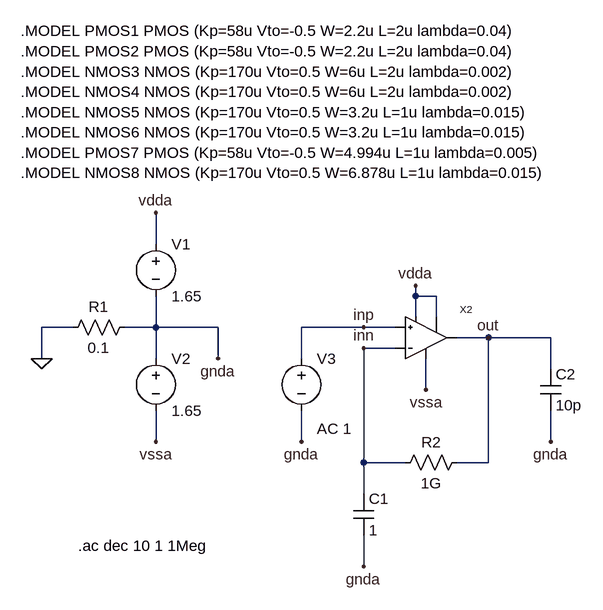
[diagram p0: schematic CMOSamp-TOP-frecuencia.asc]
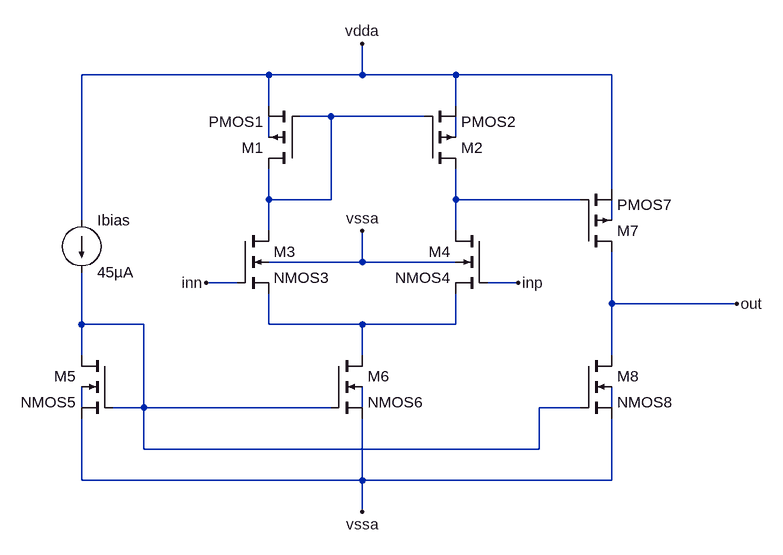
[diagram p1: sub-circuit cmosamp.asc]
CMOSamp-TOP-frecuencia.asc, the LTspice schematic file:
Version 4
SHEET 1 1168 844
WIRE -384 32 -384 -16
WIRE 16 112 16 96
WIRE 48 112 16 112
WIRE 16 144 16 112
WIRE 48 144 48 112
WIRE -512 160 -560 160
WIRE -384 160 -384 112
WIRE -384 160 -432 160
WIRE -288 160 -384 160
WIRE -64 160 -160 160
WIRE -16 160 -64 160
WIRE 128 176 80 176
WIRE 224 176 128 176
WIRE -16 192 -64 192
WIRE -560 208 -560 160
WIRE -384 208 -384 160
WIRE -288 208 -288 160
WIRE -160 208 -160 160
WIRE 224 224 224 176
WIRE 32 256 32 208
WIRE -384 336 -384 288
WIRE -160 336 -160 288
WIRE 224 336 224 288
WIRE -64 368 -64 192
WIRE 0 368 -64 368
WIRE 128 368 128 176
WIRE 128 368 80 368
WIRE -64 416 -64 368
WIRE -64 528 -64 480
FLAG -288 208 gnda
FLAG -560 208 0
FLAG -384 -16 vdda
FLAG 16 96 vdda
FLAG 32 256 vssa
FLAG -384 336 vssa
FLAG -64 160 inp
FLAG -64 192 inn
FLAG 128 176 out
FLAG -160 336 gnda
FLAG -64 528 gnda
FLAG 224 336 gnda
SYMBOL voltage -384 16 R0
WINDOW 123 0 0 Left 0
WINDOW 39 0 0 Left 0
SYMATTR InstName V1
SYMATTR Value 1.65
SYMBOL voltage -384 192 R0
WINDOW 123 0 0 Left 0
WINDOW 39 0 0 Left 0
SYMATTR InstName V2
SYMATTR Value 1.65
SYMBOL voltage -160 192 R0
WINDOW 123 24 124 Left 2
WINDOW 39 0 0 Left 0
SYMATTR Value2 AC 1
SYMATTR InstName V3
SYMATTR Value ""
SYMBOL res -416 144 R90
WINDOW 0 0 56 VBottom 2
WINDOW 3 32 56 VTop 2
SYMATTR InstName R1
SYMATTR Value 0.1
SYMBOL res 96 352 R90
WINDOW 0 0 56 VBottom 2
WINDOW 3 32 56 VTop 2
SYMATTR InstName R2
SYMATTR Value 1G
SYMBOL cap -80 416 R0
SYMATTR InstName C1
SYMATTR Value 1
SYMBOL cap 208 224 R0
SYMATTR InstName C2
SYMATTR Value 10p
SYMBOL CMOSamp 16 176 R0
SYMATTR InstName X2
TEXT -504 496 Left 2 !.ac dec 10 1 1Meg
TEXT -592 -296 Left 2 !.MODEL PMOS1 PMOS (Kp=58u Vto=-0.5 W=2.2u L=2u lambda=0.04)\n.MODEL PMOS2 PMOS (Kp=58u Vto=-0.5 W=2.2u L=2u lambda=0.04)\n.MODEL NMOS3 NMOS (Kp=170u Vto=0.5 W=6u L=2u lambda=0.002)\n.MODEL NMOS4 NMOS (Kp=170u Vto=0.5 W=6u L=2u lambda=0.002)\n.MODEL NMOS5 NMOS (Kp=170u Vto=0.5 W=3.2u L=1u lambda=0.015)\n.MODEL NMOS6 NMOS (Kp=170u Vto=0.5 W=3.2u L=1u lambda=0.015)\n.MODEL PMOS7 PMOS (Kp=58u Vto=-0.5 W=4.994u L=1u lambda=0.005)\n.MODEL NMOS8 NMOS (Kp=170u Vto=0.5 W=6.878u L=1u lambda=0.015)

cmosamp.asc, the sub-circuit schematic file:
Version 4
SHEET 1 1776 996
WIRE 80 -16 -208 -16
WIRE 224 -16 224 -64
WIRE 224 -16 80 -16
WIRE 368 -16 224 -16
WIRE 608 -16 368 -16
WIRE 80 32 80 -16
WIRE 368 32 368 -16
WIRE 176 48 128 48
WIRE 320 48 176 48
WIRE 80 80 80 48
WIRE 368 80 368 48
WIRE 608 160 608 -16
WIRE 80 176 80 128
WIRE 176 176 176 48
WIRE 176 176 80 176
WIRE 368 176 368 128
WIRE 560 176 368 176
WIRE -208 208 -208 -16
WIRE 608 208 608 176
WIRE 80 224 80 176
WIRE 368 224 368 176
WIRE 224 272 224 224
WIRE 224 272 80 272
WIRE 368 272 224 272
WIRE 32 304 -16 304
WIRE 464 304 416 304
WIRE 608 336 608 256
WIRE 800 336 608 336
WIRE -208 368 -208 288
WIRE -112 368 -208 368
WIRE 80 368 80 320
WIRE 224 368 80 368
WIRE 368 368 368 320
WIRE 368 368 224 368
WIRE -208 416 -208 368
WIRE 224 416 224 368
WIRE 608 416 608 336
WIRE -208 496 -208 464
WIRE -112 496 -112 368
WIRE -112 496 -160 496
WIRE 176 496 -112 496
WIRE 224 496 224 464
WIRE 560 496 496 496
WIRE 608 496 608 464
WIRE -112 560 -112 496
WIRE 496 560 496 496
WIRE 496 560 -112 560
WIRE -208 608 -208 512
WIRE 224 608 224 512
WIRE 224 608 -208 608
WIRE 608 608 608 512
WIRE 608 608 224 608
WIRE 224 656 224 608
FLAG 224 224 vssa
FLAG 224 -64 vdda
FLAG 224 656 vssa
FLAG -16 304 inn
FLAG 464 304 inp
FLAG 800 336 out
SYMBOL pmos4 128 128 R180
SYMATTR InstName M1
SYMATTR Value PMOS1
SYMBOL pmos4 320 128 M180
SYMATTR InstName M2
SYMATTR Value PMOS2
SYMBOL nmos4 32 224 R0
SYMATTR InstName M3
SYMATTR Value NMOS3
SYMBOL nmos4 416 224 M0
SYMATTR InstName M4
SYMATTR Value NMOS4
SYMBOL nmos4 -160 416 M0
SYMATTR InstName M5
SYMATTR Value NMOS5
SYMBOL nmos4 176 416 R0
SYMATTR InstName M6
SYMATTR Value NMOS6
SYMBOL pmos4 560 256 M180
SYMATTR InstName M7
SYMATTR Value PMOS7
SYMBOL nmos4 560 416 R0
SYMATTR InstName M8
SYMATTR Value NMOS8
SYMBOL current -208 208 R0
SYMATTR InstName Ibias
SYMATTR Value 45µA

The netlist it stands for:
* CMOSamp-TOP-frecuencia.asc
V1 vdda gnda 1.65
V2 gnda vssa 1.65
V3 inp gnda AC 1
R1 gnda 0 0.1
R2 out inn 1G
C1 inn gnda 1
C2 out gnda 10p
XX2 inp inn out vdda vssa vdda cmosamp

* block symbol definitions
.subckt cmosamp inp inn out vdda vssa vdd7
M1 N001 N001 vdda N002 PMOS1
M2 N004 N001 vdda N003 PMOS2
M3 N001 inn N007 vssa NMOS3
M4 N004 inp N007 vssa NMOS4
M5 N006 N006 vssa N008 NMOS5
M6 N007 N006 vssa N009 NMOS6
M7 out N004 vdda N005 PMOS7
M8 out N006 vssa N010 NMOS8
Ibias vdda N006 45µA
.ends cmosamp

.model NMOS NMOS
.model PMOS PMOS
.lib standard.mos
.ac dec 10 1 1Meg
.MODEL PMOS1 PMOS (Kp=58u Vto=-0.5 W=2.2u L=2u lambda=0.04)
.MODEL PMOS2 PMOS (Kp=58u Vto=-0.5 W=2.2u L=2u lambda=0.04)
.MODEL NMOS3 NMOS (Kp=170u Vto=0.5 W=6u L=2u lambda=0.002)
.MODEL NMOS4 NMOS (Kp=170u Vto=0.5 W=6u L=2u lambda=0.002)
.MODEL NMOS5 NMOS (Kp=170u Vto=0.5 W=3.2u L=1u lambda=0.015)
.MODEL NMOS6 NMOS (Kp=170u Vto=0.5 W=3.2u L=1u lambda=0.015)
.MODEL PMOS7 PMOS (Kp=58u Vto=-0.5 W=4.994u L=1u lambda=0.005)
.MODEL NMOS8 NMOS (Kp=170u Vto=0.5 W=6.878u L=1u lambda=0.015)
.backanno
.end